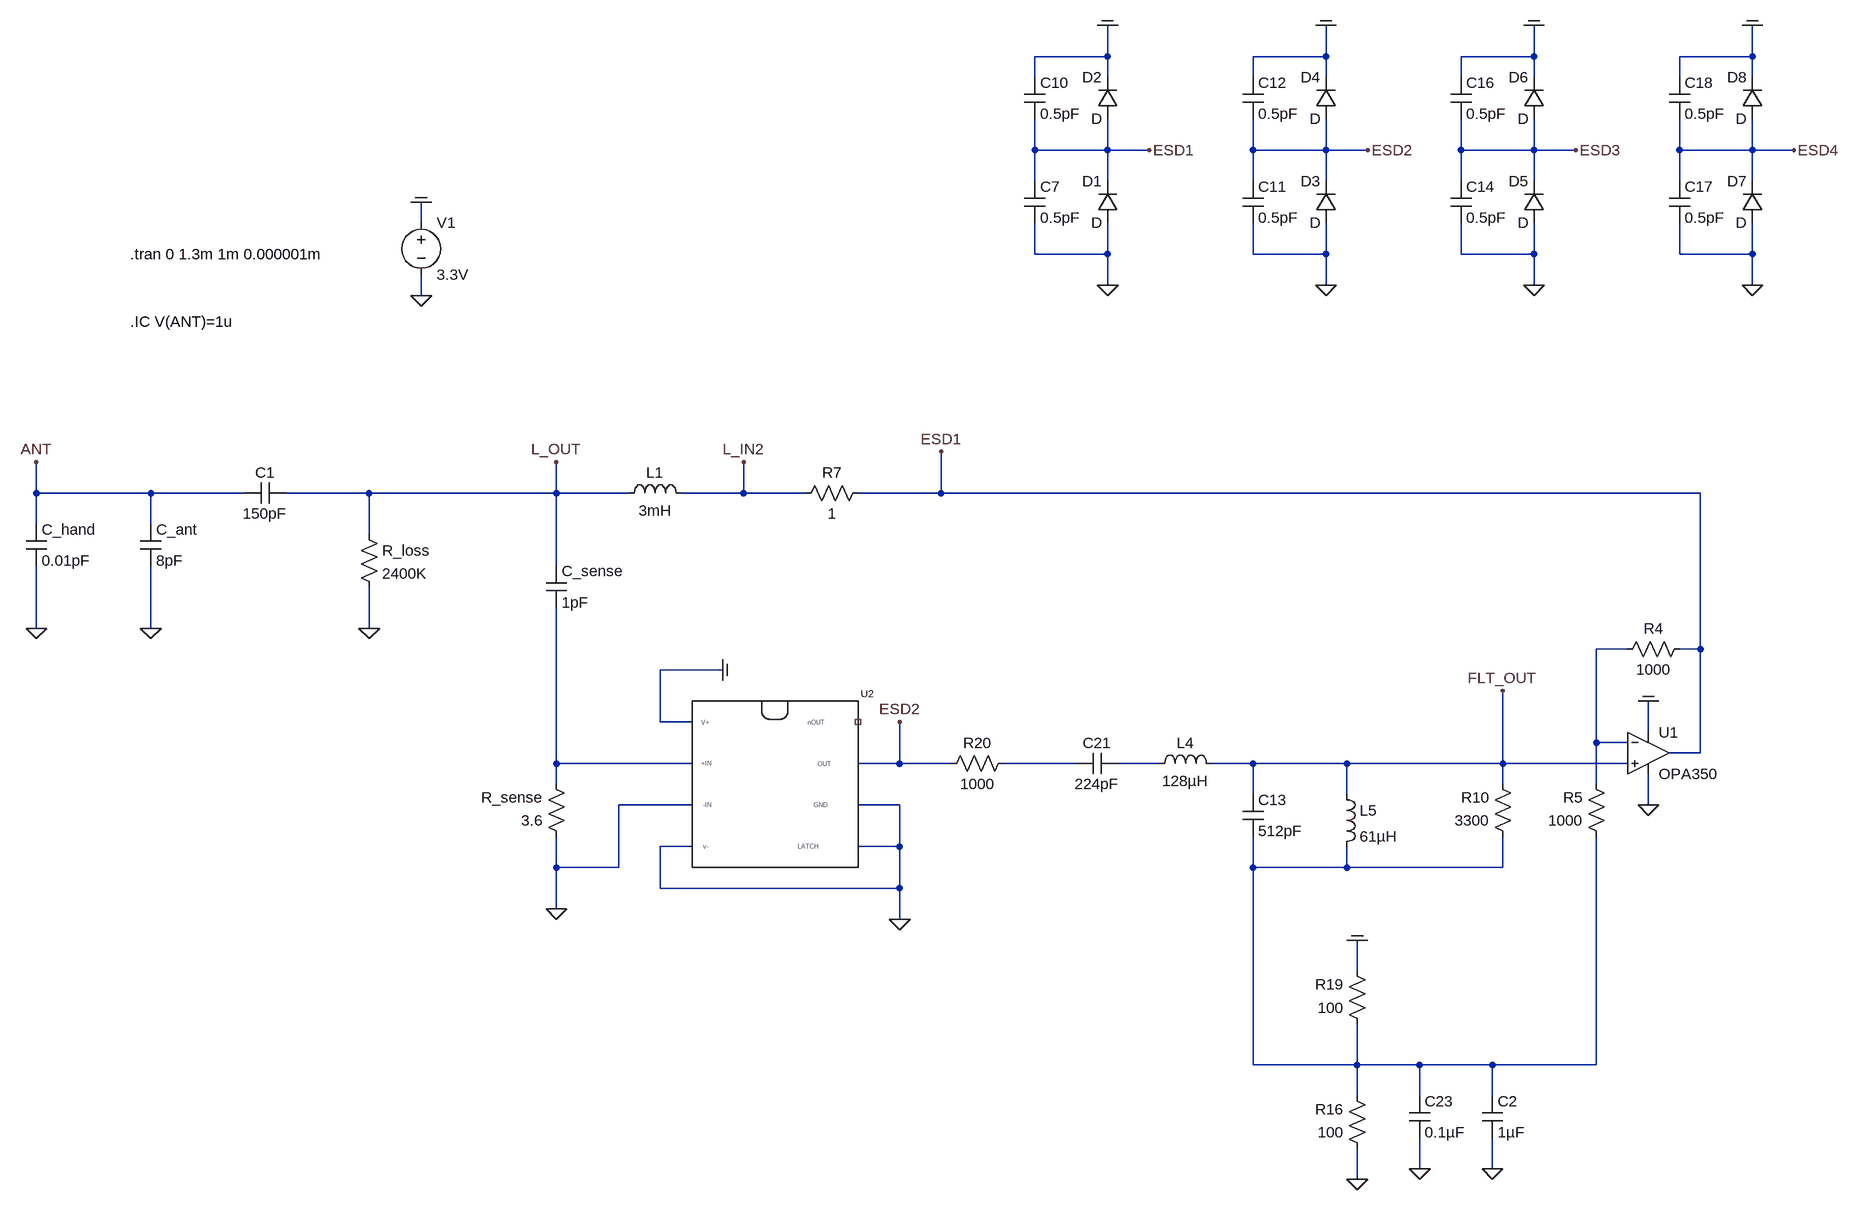
[diagram p0: schematic 2020_oscillator_experiments_v12.asc]
2020_oscillator_experiments_v12.asc, the LTspice schematic file:
Version 4
SHEET 1 3244 3076
WIRE 1056 -176 1056 -224
WIRE 1056 -176 944 -176
WIRE 1392 -176 1392 -224
WIRE 1392 -176 1280 -176
WIRE 1712 -176 1712 -224
WIRE 1712 -176 1600 -176
WIRE 2048 -176 2048 -224
WIRE 2048 -176 1936 -176
WIRE 944 -144 944 -176
WIRE 1056 -144 1056 -176
WIRE 1280 -144 1280 -176
WIRE 1392 -144 1392 -176
WIRE 1600 -144 1600 -176
WIRE 1712 -144 1712 -176
WIRE 1936 -144 1936 -176
WIRE 2048 -144 2048 -176
WIRE 944 -32 944 -80
WIRE 1056 -32 1056 -80
WIRE 1056 -32 944 -32
WIRE 1120 -32 1056 -32
WIRE 1280 -32 1280 -80
WIRE 1392 -32 1392 -80
WIRE 1392 -32 1280 -32
WIRE 1456 -32 1392 -32
WIRE 1600 -32 1600 -80
WIRE 1712 -32 1712 -80
WIRE 1712 -32 1600 -32
WIRE 1776 -32 1712 -32
WIRE 1936 -32 1936 -80
WIRE 2048 -32 2048 -80
WIRE 2048 -32 1936 -32
WIRE 2112 -32 2048 -32
WIRE 944 16 944 -32
WIRE 1056 16 1056 -32
WIRE 1280 16 1280 -32
WIRE 1392 16 1392 -32
WIRE 1600 16 1600 -32
WIRE 1712 16 1712 -32
WIRE 1936 16 1936 -32
WIRE 2048 16 2048 -32
WIRE 0 80 0 48
WIRE 944 128 944 80
WIRE 1056 128 1056 80
WIRE 1056 128 944 128
WIRE 1280 128 1280 80
WIRE 1392 128 1392 80
WIRE 1392 128 1280 128
WIRE 1600 128 1600 80
WIRE 1712 128 1712 80
WIRE 1712 128 1600 128
WIRE 1936 128 1936 80
WIRE 2048 128 2048 80
WIRE 2048 128 1936 128
WIRE 1056 176 1056 128
WIRE 1392 176 1392 128
WIRE 1712 176 1712 128
WIRE 2048 176 2048 128
WIRE 0 192 0 160
WIRE -592 496 -592 448
WIRE -416 496 -592 496
WIRE -272 496 -416 496
WIRE -80 496 -208 496
WIRE 208 496 208 448
WIRE 208 496 -80 496
WIRE 320 496 208 496
WIRE 496 496 496 448
WIRE 496 496 400 496
WIRE 592 496 496 496
WIRE 800 496 800 432
WIRE 800 496 672 496
WIRE 1968 496 800 496
WIRE -592 544 -592 496
WIRE -416 544 -416 496
WIRE -80 560 -80 496
WIRE 208 608 208 496
WIRE -592 704 -592 608
WIRE -416 704 -416 608
WIRE -80 704 -80 640
WIRE 1856 736 1808 736
WIRE 1968 736 1968 496
WIRE 1968 736 1936 736
WIRE 464 768 368 768
WIRE 368 848 368 768
WIRE 416 848 368 848
WIRE 1888 864 1888 816
WIRE 1808 880 1808 736
WIRE 1856 880 1808 880
WIRE 1968 896 1968 736
WIRE 1968 896 1920 896
WIRE 208 912 208 672
WIRE 416 912 208 912
WIRE 736 912 736 848
WIRE 736 912 672 912
WIRE 816 912 736 912
WIRE 1008 912 896 912
WIRE 1136 912 1072 912
WIRE 1280 912 1216 912
WIRE 1424 912 1280 912
WIRE 1664 912 1664 800
WIRE 1664 912 1424 912
WIRE 1856 912 1664 912
WIRE 208 944 208 912
WIRE 1664 944 1664 912
WIRE 1808 944 1808 880
WIRE 1280 960 1280 912
WIRE 1424 960 1424 912
WIRE 416 976 304 976
WIRE 736 976 672 976
WIRE 1888 976 1888 928
WIRE 416 1040 368 1040
WIRE 736 1040 736 976
WIRE 736 1040 672 1040
WIRE 208 1072 208 1024
WIRE 304 1072 304 976
WIRE 304 1072 208 1072
WIRE 1280 1072 1280 1024
WIRE 1424 1072 1424 1040
WIRE 1424 1072 1280 1072
WIRE 1664 1072 1664 1024
WIRE 1664 1072 1424 1072
WIRE 368 1104 368 1040
WIRE 736 1104 736 1040
WIRE 736 1104 368 1104
WIRE 208 1136 208 1072
WIRE 736 1152 736 1104
WIRE 1440 1232 1440 1184
WIRE 1280 1376 1280 1072
WIRE 1440 1376 1440 1312
WIRE 1440 1376 1280 1376
WIRE 1536 1376 1440 1376
WIRE 1648 1376 1536 1376
WIRE 1808 1376 1808 1024
WIRE 1808 1376 1648 1376
WIRE 1440 1424 1440 1376
WIRE 1536 1424 1536 1376
WIRE 1648 1424 1648 1376
WIRE 1536 1536 1536 1488
WIRE 1648 1536 1648 1488
WIRE 1440 1552 1440 1504
FLAG 0 192 0
FLAG 0 48 COM
FLAG 1056 176 0
FLAG 1056 -224 COM
FLAG 1120 -32 ESD1
FLAG 1392 176 0
FLAG 1392 -224 COM
FLAG 1456 -32 ESD2
FLAG -592 448 ANT
FLAG -592 704 0
FLAG -416 704 0
FLAG -80 704 0
FLAG 496 448 L_IN2
FLAG 208 448 L_OUT
FLAG 1712 176 0
FLAG 1712 -224 COM
FLAG 1776 -32 ESD3
FLAG 2048 176 0
FLAG 2048 -224 COM
FLAG 2112 -32 ESD4
FLAG 1664 800 FLT_OUT
FLAG 800 432 ESD1
FLAG 1440 1552 0
FLAG 1440 1184 COM
FLAG 1536 1536 0
FLAG 1888 816 COM
FLAG 1888 976 0
FLAG 736 1152 0
FLAG 464 768 COM
FLAG 208 1136 0
FLAG 736 848 ESD2
FLAG 1648 1536 0
SYMBOL voltage 0 64 R0
WINDOW 123 0 0 Left 0
WINDOW 39 0 0 Left 0
SYMATTR InstName V1
SYMATTR Value 3.3V
SYMBOL diode 1072 80 R180
WINDOW 0 24 64 Left 2
WINDOW 3 24 0 Left 2
SYMATTR InstName D1
SYMBOL diode 1072 -80 R180
WINDOW 0 24 64 Left 2
WINDOW 3 24 0 Left 2
SYMATTR InstName D2
SYMBOL cap 928 16 R0
SYMATTR InstName C7
SYMATTR Value 0.5pF
SYMBOL cap 928 -144 R0
SYMATTR InstName C10
SYMATTR Value 0.5pF
SYMBOL diode 1408 80 R180
WINDOW 0 24 64 Left 2
WINDOW 3 24 0 Left 2
SYMATTR InstName D3
SYMBOL diode 1408 -80 R180
WINDOW 0 24 64 Left 2
WINDOW 3 24 0 Left 2
SYMATTR InstName D4
SYMBOL cap 1264 16 R0
SYMATTR InstName C11
SYMATTR Value 0.5pF
SYMBOL cap 1264 -144 R0
SYMATTR InstName C12
SYMATTR Value 0.5pF
SYMBOL ind 304 512 R270
WINDOW 0 32 56 VTop 2
WINDOW 3 5 56 VBottom 2
SYMATTR InstName L1
SYMATTR Value 3mH
SYMATTR SpiceLine Rser=120 Rpar=20Meg
SYMBOL cap -432 544 R0
SYMATTR InstName C_ant
SYMATTR Value 8pF
SYMBOL cap -608 544 R0
SYMATTR InstName C_hand
SYMATTR Value 0.01pF
SYMBOL res -96 544 R0
SYMATTR InstName R_loss
SYMATTR Value 2400K
SYMBOL res 688 480 R90
WINDOW 0 0 56 VBottom 2
WINDOW 3 32 56 VTop 2
SYMATTR InstName R7
SYMATTR Value 1
SYMBOL cap 192 608 R0
SYMATTR InstName C_sense
SYMATTR Value 1pF
SYMBOL diode 1728 80 R180
WINDOW 0 24 64 Left 2
WINDOW 3 24 0 Left 2
SYMATTR InstName D5
SYMBOL diode 1728 -80 R180
WINDOW 0 24 64 Left 2
WINDOW 3 24 0 Left 2
SYMATTR InstName D6
SYMBOL cap 1584 16 R0
SYMATTR InstName C14
SYMATTR Value 0.5pF
SYMBOL cap 1584 -144 R0
SYMATTR InstName C16
SYMATTR Value 0.5pF
SYMBOL diode 2064 80 R180
WINDOW 0 24 64 Left 2
WINDOW 3 24 0 Left 2
SYMATTR InstName D7
SYMBOL diode 2064 -80 R180
WINDOW 0 24 64 Left 2
WINDOW 3 24 0 Left 2
SYMATTR InstName D8
SYMBOL cap 1920 16 R0
SYMATTR InstName C17
SYMATTR Value 0.5pF
SYMBOL cap 1920 -144 R0
SYMATTR InstName C18
SYMATTR Value 0.5pF
SYMBOL res 224 1040 R180
WINDOW 0 36 76 Left 2
WINDOW 3 36 40 Left 2
SYMATTR InstName R_sense
SYMATTR Value 3.6
SYMBOL cap 1072 896 R90
WINDOW 0 0 32 VBottom 2
WINDOW 3 32 32 VTop 2
SYMATTR InstName C21
SYMATTR Value 224pF
SYMBOL ind 1120 928 R270
WINDOW 0 32 56 VTop 2
WINDOW 3 5 56 VBottom 2
SYMATTR InstName L4
SYMATTR Value 128µH
SYMATTR SpiceLine Rser=10
SYMBOL res 1680 1040 R180
WINDOW 0 36 76 Left 2
WINDOW 3 36 40 Left 2
SYMATTR InstName R10
SYMATTR Value 3300
SYMBOL cap 1264 960 R0
SYMATTR InstName C13
SYMATTR Value 512pF
SYMBOL ind 1408 944 R0
SYMATTR InstName L5
SYMATTR Value 61µH
SYMATTR SpiceLine Rser=5
SYMBOL res 1456 1520 R180
WINDOW 0 36 76 Left 2
WINDOW 3 36 40 Left 2
SYMATTR InstName R16
SYMATTR Value 100
SYMBOL res 1456 1328 R180
WINDOW 0 36 76 Left 2
WINDOW 3 36 40 Left 2
SYMATTR InstName R19
SYMATTR Value 100
SYMBOL cap 1520 1424 R0
SYMATTR InstName C23
SYMATTR Value 0.1µF
SYMBOL res 912 896 R90
WINDOW 0 0 56 VBottom 2
WINDOW 3 32 56 VTop 2
SYMATTR InstName R20
SYMATTR Value 1000
SYMBOL res 1840 752 R270
WINDOW 0 32 56 VTop 2
WINDOW 3 0 56 VBottom 2
SYMATTR InstName R4
SYMATTR Value 1000
SYMBOL res 1824 1040 R180
WINDOW 0 36 76 Left 2
WINDOW 3 36 40 Left 2
SYMATTR InstName R5
SYMATTR Value 1000
SYMBOL SBORKA\\OPamp\\OPA350 1888 896 R0
SYMATTR InstName U1
SYMBOL ad8611 544 944 R0
SYMATTR InstName U2
SYMBOL cap -208 480 R90
WINDOW 0 0 32 VBottom 2
WINDOW 3 32 32 VTop 2
SYMATTR InstName C1
SYMATTR Value 150pF
SYMBOL cap 1632 1424 R0
SYMATTR InstName C2
SYMATTR Value 1µF
TEXT -448 128 Left 2 !.tran 0 1.3m 1m 0.000001m
TEXT -448 232 Left 2 !.IC V(ANT)=1u

The netlist it stands for:
* 2020_oscillator_experiments_v12.asc
V1 COM 0 3.3V
D1 0 ESD1 D
D2 ESD1 COM D
C7 ESD1 0 0.5pF
C10 COM ESD1 0.5pF
D3 0 ESD2 D
D4 ESD2 COM D
C11 ESD2 0 0.5pF
C12 COM ESD2 0.5pF
L1 L_OUT L_IN2 3mH Rser=120 Rpar=20Meg
C_ant ANT 0 8pF
C_hand ANT 0 0.01pF
R_loss L_OUT 0 2400K
R7 ESD1 L_IN2 1
C_sense L_OUT N002 1pF
D5 0 ESD3 D
D6 ESD3 COM D
C14 ESD3 0 0.5pF
C16 COM ESD3 0.5pF
D7 0 ESD4 D
D8 ESD4 COM D
C17 ESD4 0 0.5pF
C18 COM ESD4 0.5pF
R_sense 0 N002 3.6
C21 N004 N003 224pF
L4 N004 FLT_OUT 128µH Rser=10
R10 N005 FLT_OUT 3300
C13 FLT_OUT N005 512pF
L5 FLT_OUT N005 61µH Rser=5
R16 0 N005 100
R19 N005 COM 100
C23 N005 0 0.1µF
R20 N003 ESD2 1000
R4 N001 ESD1 1000
R5 N005 N001 1000
* U1: OPA350 (symbol SBORKA\OPamp\OPA350 not available, pins judged from their places): In+=FLT_OUT In-=N001 V+=COM V-=0 OUT=ESD1
XU2 N002 0 COM 0 0 0 ESD2 NC_01 ad8611  ; pins +IN -IN V+ V- Latch GND OUT nOUT
C1 L_OUT ANT 150pF
C2 N005 0 1µF
.model D D
.lib standard.dio
.tran 0 1.3m 1m 0.000001m
.IC V(ANT)=1u
.lib AD8611.cir
.backanno
.end